# EAGLE design HeadsetCCup (EAGLE 6.5.0)
ECE477 Senior Design Project Augmented Reality Simulator board utilizing STM32F4 and Raspberry PI
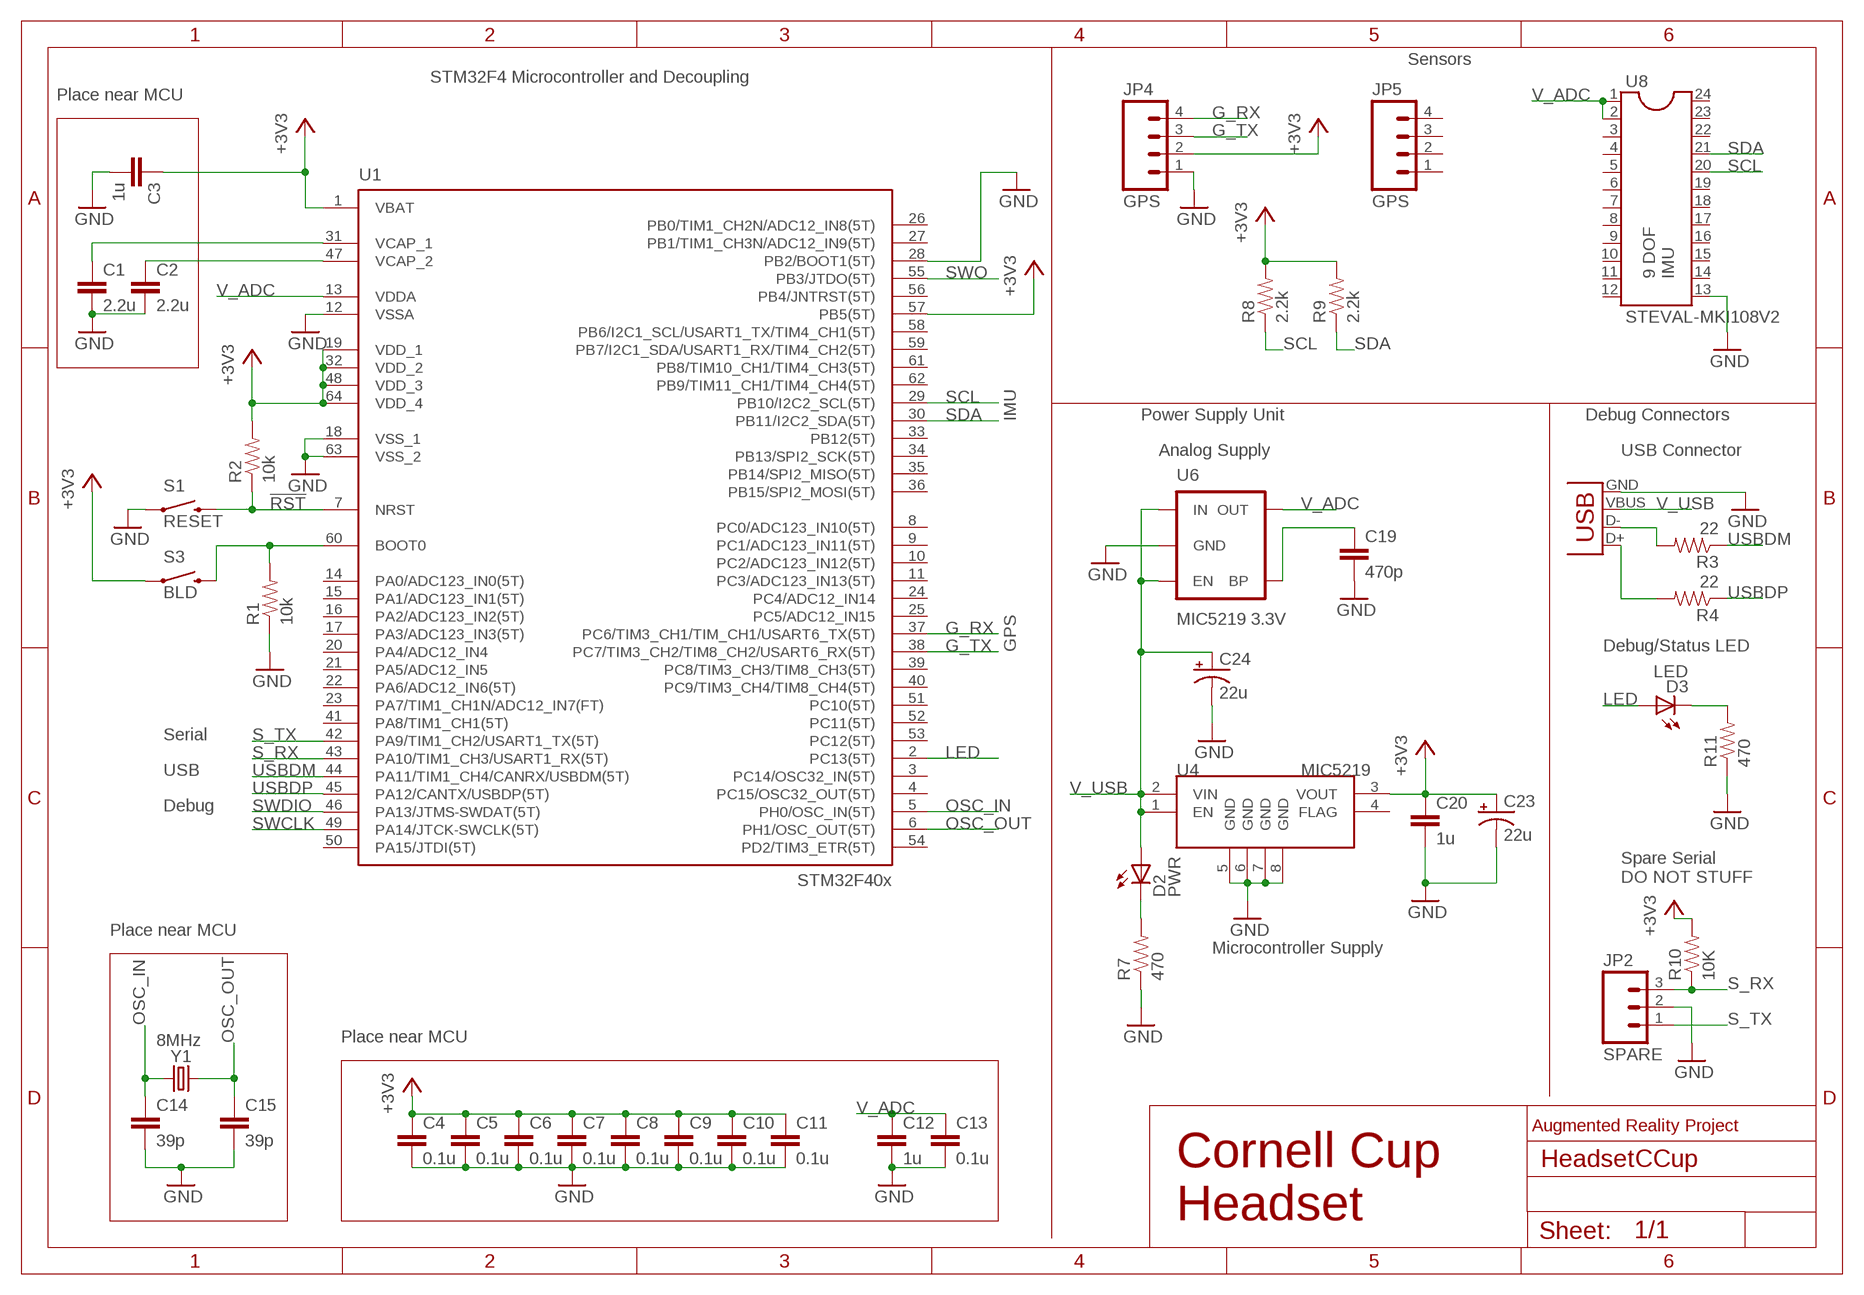
[diagram p0: schematic, sheet 1]

## Parts
C1  2.2u  CAP1206  [1206]
C2  2.2u  CAP1206  [1206]
C3  1u  CAP1206  [1206]
C4  0.1u  CAP1206  [1206]
C5  0.1u  CAP1206  [1206]
C6  0.1u  CAP1206  [1206]
C7  0.1u  CAP1206  [1206]
C8  0.1u  CAP1206  [1206]
C9  0.1u  CAP1206  [1206]
C10  0.1u  CAP1206  [1206]
C11  0.1u  CAP1206  [1206]
C12  1u  CAP1206  [1206]
C13  0.1u  CAP1206  [1206]
C14  39p  CAP1206  [1206]
C15  39p  CAP1206  [1206]
C19  470p  CAP1206  [1206]
C20  1u  CAP1206  [1206]
C23  22u  CAP_POLD  [PANASONIC_D]
C24  22u  CAP_POLD  [PANASONIC_D]
D2  PWR  LED-RED1206  [LED-1206]
D3  LED  LED-RED1206  [LED-1206]
JP1  USBSMD  [USB-MINIB]
JP2  SPARE  M03PTH  [1X03]
JP4  GPS  M04PTH  [1X04]
JP5  GPS  M04PTH  [1X04]
R1  10k  RES1206  [1206]
R2  10k  RES1206  [1206]
R3  22  RES1206  [1206]
R4  22  RES1206  [1206]
R7  470  RES1206  [1206]
R8  2.2k  RES1206  [1206]
R9  2.2k  RES1206  [1206]
R10  10K  RES1206  [1206]
R11  470  RES1206  [1206]
S1  RESET  SWITCH-MOMENTARY-2PTH  [TACTILE-PTH]
S3  BLD  SWITCH-MOMENTARY-2PTH  [TACTILE-PTH]
U1  STM32F405RGT6  STM32F405R  [TQFP64]
U4  MIC5219  V_REG_MIC5216  [MSOP8]
U6  MIC5219 3.3V  V_REG_MIC52193.3V  [SOT23-5]
U8  STEVAL-MKI108V2  DIL24-6  [DIL24-6]
Y1  8MHz  CRYSTALHC49US  [HC49US]

## Nets
!RST!: R2.1 S1.3 U1.7(NRST)
+3V3: C3.1 C4.1 C5.1 C6.1 C7.1 C8.1 C9.1 C10.1 C11.1 C20.1 C23.+ JP4.2 R2.2 R8.2 R9.2 R10.2 S3.1 U1.1(VBAT) U1.19(VDD_1) U1.32(VDD_2) U1.48(VDD_3) U1.57(PB5(5T)) U1.64(VDD_4) U4.3(VOUT)
BOOT0: R1.2 S3.3 U1.60(BOOT0)
G_RX: JP4.4 U1.37(PC6/TIM3_CH1/TIM_CH1/USART6_TX(5T))
G_TX: JP4.3 U1.38(PC7/TIM3_CH2/TIM8_CH2/USART6_RX(5T))
GND: C1.2 C2.2 C3.2 C4.2 C5.2 C6.2 C7.2 C8.2 C9.2 C10.2 C11.2 C12.2 C13.2 C14.2 C15.2 C19.2 C20.2 C23.- C24.- JP1.GND JP2.2 JP4.1 R1.1 R7.1 R11.1 S1.1 U1.12(VSSA) U1.18(VSS_1) U1.28(PB2/BOOT1(5T)) U1.63(VSS_2) U4.5(GND) U4.6(GND) U4.7(GND) U4.8(GND) U6.2(GND) U8.13
LED: D3.A U1.2(PC13(5T))
LED_LED: D3.C R11.2
OSC_IN: C14.1 U1.5(PH0/OSC_IN(5T)) Y1.1
OSC_OUT: C15.1 U1.6(PH1/OSC_OUT(5T)) Y1.2
PWR_LED: D2.C R7.2
S_RX: JP2.3 R10.1 U1.43(PA10/TIM1_CH3/USART1_RX(5T))
S_TX: JP2.1 U1.42(PA9/TIM1_CH2/USART1_TX(5T))
SCL: R8.1 U1.29(PB10/I2C2_SCL(5T)) U8.20
SDA: R9.1 U1.30(PB11/I2C2_SDA(5T)) U8.21
SWCLK: U1.49(PA14/JTCK-SWCLK(5T))
SWDIO: U1.46(PA13/JTMS-SWDAT(5T))
SWO: U1.55(PB3/JTDO(5T))
USB_D+: JP1.D+ R4.2
USB_D-: JP1.D- R3.2
USBDM: R3.1 U1.44(PA11/TIM1_CH4/CANRX/USBDM(5T))
USBDP: R4.1 U1.45(PA12/CANTX/USBDP(5T))
V_ADC: C12.1 C13.1 U1.13(VDDA) U6.5(OUT) U8.1 U8.2
V_BYP: C19.1 U6.4(BP)
V_USB: C24.+ D2.A JP1.VBUS U4.1(EN) U4.2(VIN) U6.1(IN) U6.3(EN)
VCAP1: C1.1 U1.31(VCAP_1)
VCAP2: C2.1 U1.47(VCAP_2)
Unconnected: JP5.1 JP5.2 JP5.3 JP5.4 U1.3(PC14/OSC32_IN(5T)) U1.4(PC15/OSC32_OUT(5T)) U1.8(PC0/ADC123_IN10(5T)) U1.9(PC1/ADC123_IN11(5T)) U1.10(PC2/ADC123_IN12(5T)) U1.11(PC3/ADC123_IN13(5T)) U1.14(PA0/ADC123_IN0(5T)) U1.15(PA1/ADC123_IN1(5T)) U1.16(PA2/ADC123_IN2(5T)) U1.17(PA3/ADC123_IN3(5T)) U1.20(PA4/ADC12_IN4) U1.21(PA5/ADC12_IN5) U1.22(PA6/ADC12_IN6(5T)) U1.23(PA7/TIM1_CH1N/ADC12_IN7(FT)) U1.24(PC4/ADC12_IN14) U1.25(PC5/ADC12_IN15) U1.26(PB0/TIM1_CH2N/ADC12_IN8(5T)) U1.27(PB1/TIM1_CH3N/ADC12_IN9(5T)) U1.33(PB12(5T)) U1.34(PB13/SPI2_SCK(5T)) U1.35(PB14/SPI2_MISO(5T)) U1.36(PB15/SPI2_MOSI(5T)) U1.39(PC8/TIM3_CH3/TIM8_CH3(5T)) U1.40(PC9/TIM3_CH4/TIM8_CH4(5T)) U1.41(PA8/TIM1_CH1(5T)) U1.50(PA15/JTDI(5T)) U1.51(PC10(5T)) U1.52(PC11(5T)) U1.53(PC12(5T)) U1.54(PD2/TIM3_ETR(5T)) U1.56(PB4/JNTRST(5T)) U1.58(PB6/I2C1_SCL/USART1_TX/TIM4_CH1(5T)) U1.59(PB7/I2C1_SDA/USART1_RX/TIM4_CH2(5T)) U1.61(PB8/TIM10_CH1/TIM4_CH3(5T)) U1.62(PB9/TIM11_CH1/TIM4_CH4(5T)) U4.4(FLAG) U8.3 U8.4 U8.5 U8.6 U8.7 U8.8 U8.9 U8.10 U8.11 U8.12 U8.14 U8.15 U8.16 U8.17 U8.18 U8.19 U8.22 U8.23 U8.24

## Notes on the sheet
- Sensors
- STM32F4 Microcontroller and Decoupling
- Place near MCU
- 9 DOF
  IMU
- IMU | Power Supply Unit | Debug Connectors
- Analog Supply | USB Connector
- GPS | Debug/Status LED
- Serial
- USB
- Debug
- Spare Serial
  DO NOT STUFF
- Place near MCU
- Microcontroller Supply
- Place near MCU
- Augmented Reality Project
- Cornell Cup
  Headset

## Library data of the parts
C1-C15 C19 C20 = ECE477:CAP: Capacitor Standard 0603 ceramic capacitor, and 0.1" leaded capacitor.
C23 C24 = SparkFun-Passives:CAP_POL: Capacitor Polarized These are standard SMD and PTH capacitors. Normally 10uF, 47uF, and 100uF in electrolytic and tantalum varieties. Always verify the external diameter of the through hole cap, it varies with capacity, voltage, and manufacturer. The EIA devices should be standard.
D2 D3 = SparkFun-LED:LED-RED: Assorted Red LEDs LilyPad 1206- DIO-09912 1206- DIO-00809 0603- DIO-00819; PROD_ID: DIO-00809; VALUE: RED
JP1 = SparkFun-Connectors:USB: USB Connectors USB-B-PTH is fully proven SKU : PRT-00139/CONN-08278 USB-miniB is fully proven SKU : PRT-00587 USB-A-PCB is untested. USB-A-H is throughly reviewed, but untested. Spark Fun Electronics SKU : PRT-00437 USB-B-SMT is throughly reviewed, but untested. Needs silkscreen touching up. USB-A-S has not been used/tested USB-MB-H has not been used/tested USB-MICROB has been used. CONN-09505
JP2 = SparkFun-Connectors:M03: Header 3 Standard 3-pin 0.1" header. Use with straight break away headers (SKU : PRT-00116), right angle break away headers (PRT-00553), swiss pins (PRT-00743), machine pins (PRT-00117), and female headers (PRT-00115). Molex polarized connector foot print use with SKU : PRT-08232 with associated crimp pins and housings.
JP4 JP5 = SparkFun-Connectors:M04: Header 4 Standard 4-pin 0.1" header. Use with straight break away headers (SKU : PRT-00116), right angle break away headers (PRT-00553), swiss pins (PRT-00743), machine pins (PRT-00117), and female headers (PRT-00115). Molex polarized connector foot print use with SKU : PRT-08231 with associated crimp pins and housings. 1MM SMD Version SKU: PRT-10208
R1-R4 R7-R11 = ECE477:RES: RESISTOR Surface-mount resistors
S1 S3 = SparkFun-Electromechanical:SWITCH-MOMENTARY-2: Various NO switches- pushbuttons, reed, etc
U1 = ECE477:STM32F405R: STM32F405 64 pin LQFP reviewed: YES tested: YES
U4 = SparkFun-PowerIC:V_REG_MIC5216: 500mA LDO, MSOP8 for better dissipation
U6 = SparkFun-PowerIC:V_REG_MIC5219: V_REG MIC5219 Standard 500mA LDO voltage regulator in SOT-23 layout. Micrel part MIC5219. BP (by-pass) pin is used to lower output noise with 470pF cap, may be left open.; PROD_ID: VREG-09872
U8 = ic-package:DIL24: Dual In Line
Y1 = SparkFun-FreqCtrl:CRYSTAL: Various standard crystals. Proven footprints. Spark Fun Electronics SKU : COM-00534

## Board
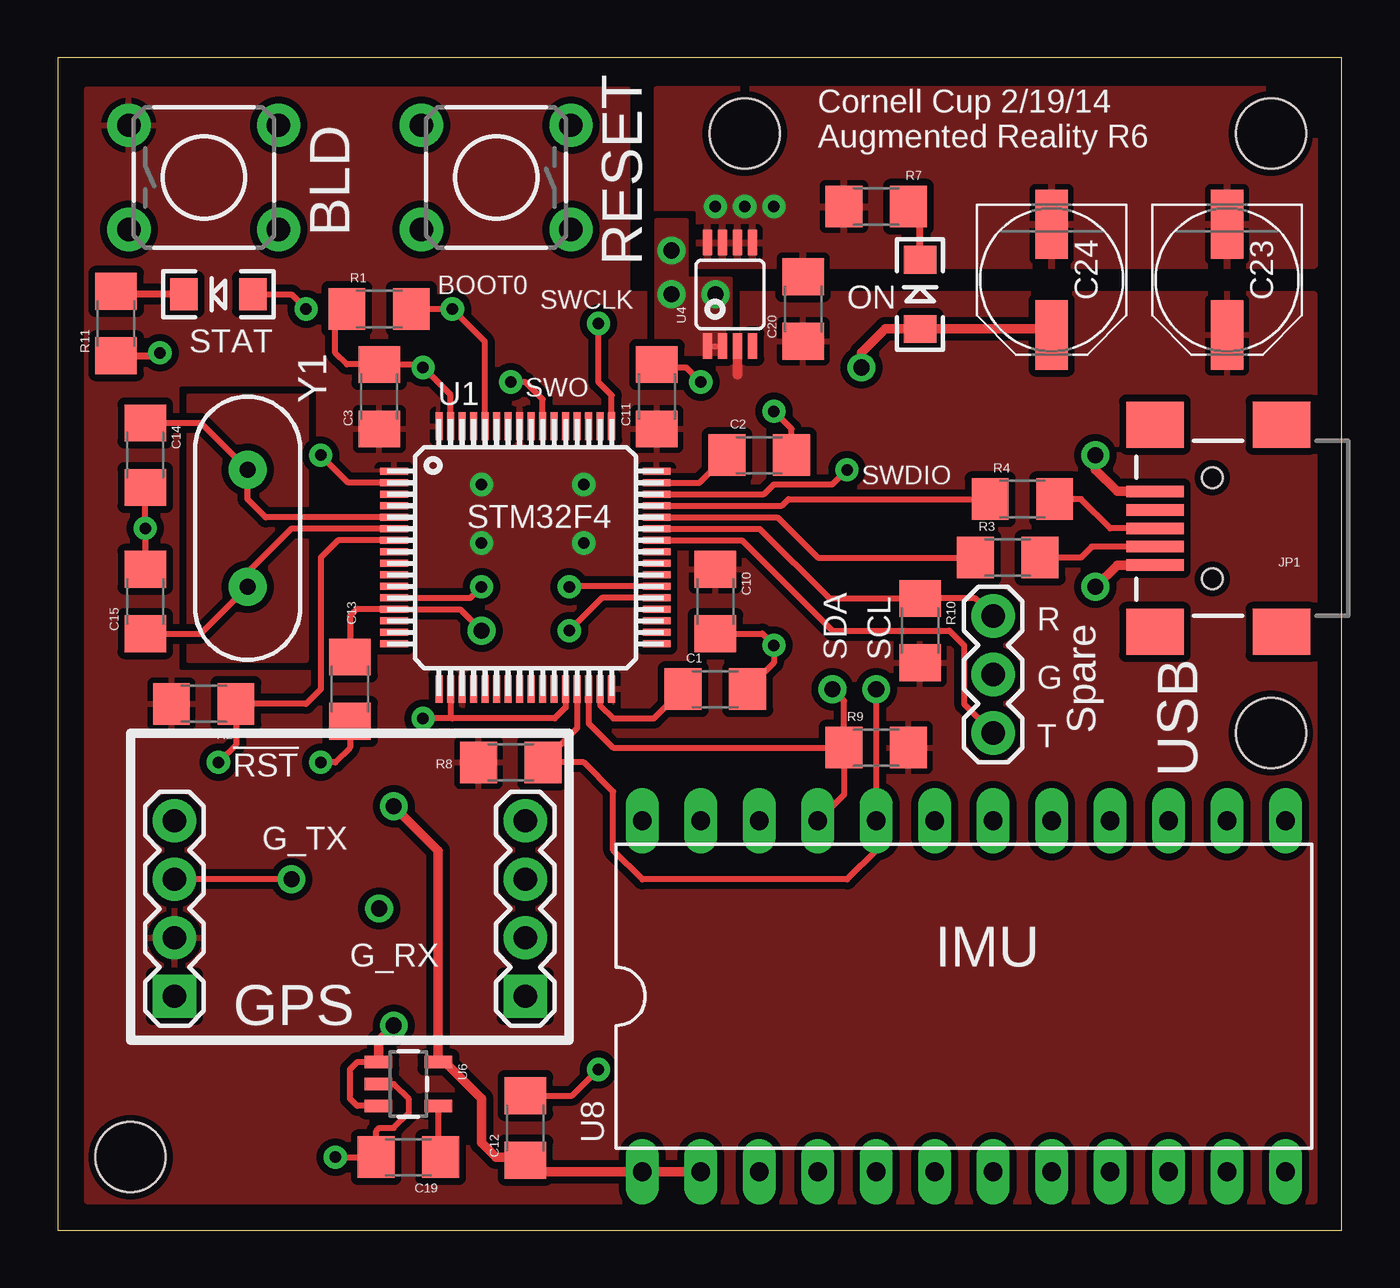
[diagram p1: board, top side]
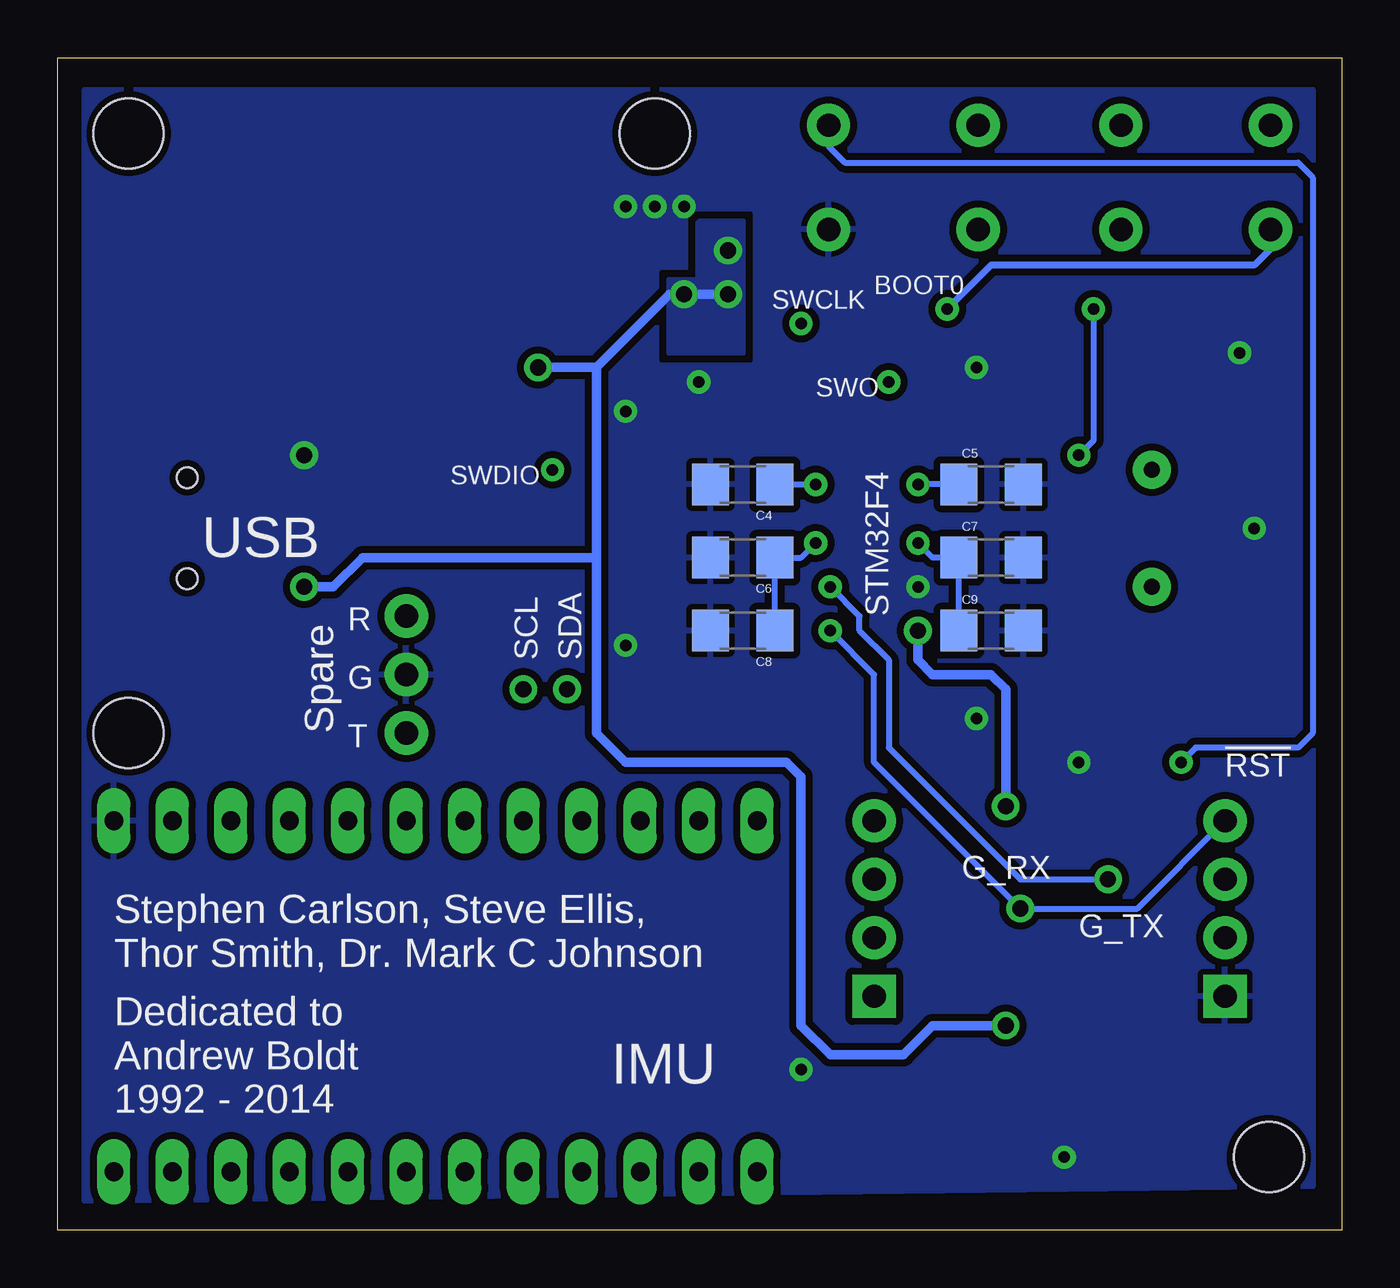
[diagram p2: board, bottom side, seen from below]

Size 55.79 x 50.92 mm. Coordinates in mm from the lower left corner, seen from the top.
Outline: 0,0 55.79,0 55.79,50.92 0,50.92 0,0
Copper layers (1*16): Top 0.035mm / dielectric 1.5mm / Bottom 0.035mm
Design rules "SparkFun *": minimum track width 8mil, minimum drill 15mil, track to track 8mil, track to pad 8mil, pad to pad 8mil, via to via 8mil, smd to smd 8mil, copper to edge 10mil, drill to drill 8mil, minimum pad ring 12mil, minimum via ring 10mil, stop-mask expansion 4mil, vias tented up to drill 25mil, thermal gap 10mil
Holes 3.05 mm at 52.7,47.62 3.17,3.17 29.84,47.62 52.7,21.59

### Footprints (pad centres in the part's own frame; a part is rotated, then mirrored left to right if it is on the bottom)
1206 = smd 1.6 x 1.8: 1 -1.4,0; 2 1.4,0
PANASONIC_D = smd 3 x 1.4: + 2.4,0; - -2.4,0
LED-1206 = smd 1.2 x 1.4: A -1.5,0; C 1.5,0
USB-MINIB = smd 2.5 x 0.5: D+ 2.5,0; D- 2.5,0.8; GND 2.5,-1.6; ID 2.5,-0.8; VBUS 2.5,1.6 | smd 2.5 x 2: MTN1 -3,4.5; MTN2 2.5,4.5; MTN3 -3,-4.5; MTN4 2.5,-4.5 | hole 0.9: 0,2.2; 0,-2.2
1X03 = drill 1.016 pad 1.88: 1 0,0; 2 2.54,0; 3 5.08,0
1X04 = drill 1.016 pad 1.88 square: 1 0,0 | drill 1.016 pad 1.88: 2 2.54,0; 3 5.08,0; 4 7.62,0
TACTILE-PTH = drill 1.016 pad 1.88: 1 -3.251,2.261; 2 3.251,2.261; 3 -3.251,-2.261; 4 3.251,-2.261
TQFP64 = smd 1.2 x 0.3: 1 -5.7,3.75; 2 -5.7,3.25; 3 -5.7,2.75; 4 -5.7,2.25; 5 -5.7,1.75; 6 -5.7,1.25; 7 -5.7,0.75; 8 -5.7,0.25; 9 -5.7,-0.25; 10 -5.7,-0.75; 11 -5.7,-1.25; 12 -5.7,-1.75; 13 -5.7,-2.25; 14 -5.7,-2.75; 15 -5.7,-3.25; 16 -5.7,-3.75; 33 5.7,-3.75; 34 5.7,-3.25; 35 5.7,-2.75; 36 5.7,-2.25; 37 5.7,-1.75; 38 5.7,-1.25; 39 5.7,-0.75; 40 5.7,-0.25; 41 5.7,0.25; 42 5.7,0.75; 43 5.7,1.25; 44 5.7,1.75; 45 5.7,2.25; 46 5.7,2.75; 47 5.7,3.25; 48 5.7,3.75 | smd 0.3 x 1.2: 17 -3.75,-5.7; 18 -3.25,-5.7; 19 -2.75,-5.7; 20 -2.25,-5.7; 21 -1.75,-5.7; 22 -1.25,-5.7; 23 -0.75,-5.7; 24 -0.25,-5.7; 25 0.25,-5.7; 26 0.75,-5.7; 27 1.25,-5.7; 28 1.75,-5.7; 29 2.25,-5.7; 30 2.75,-5.7; 31 3.25,-5.7; 32 3.75,-5.7; 49 3.75,5.7; 50 3.25,5.7; 51 2.75,5.7; 52 2.25,5.7; 53 1.75,5.7; 54 1.25,5.7; 55 0.75,5.7; 56 0.25,5.7; 57 -0.25,5.7; 58 -0.75,5.7; 59 -1.25,5.7; 60 -1.75,5.7; 61 -2.25,5.7; 62 -2.75,5.7; 63 -3.25,5.7; 64 -3.75,5.7
MSOP8 = smd 0.4 x 1.1: 1 -0.975,-2.25; 2 -0.325,-2.25; 3 0.325,-2.25; 4 0.975,-2.25; 5 0.975,2.25; 6 0.325,2.25; 7 -0.325,2.25; 8 -0.975,2.25
SOT23-5 = smd 0.55 x 1.2: 1 -0.95,-1.3; 2 0,-1.3; 3 0.95,-1.3; 4 0.95,1.3; 5 -0.95,1.3
DIL24-6 = drill 0.813 long: 1 -13.97,-7.62; 2 -11.43,-7.62; 3 -8.89,-7.62; 4 -6.35,-7.62; 5 -3.81,-7.62; 6 -1.27,-7.62; 7 1.27,-7.62; 8 3.81,-7.62; 9 6.35,-7.62; 10 8.89,-7.62; 11 11.43,-7.62; 12 13.97,-7.62; 13 13.97,7.62; 14 11.43,7.62; 15 8.89,7.62; 16 6.35,7.62; 17 3.81,7.62; 18 1.27,7.62; 19 -1.27,7.62; 20 -3.81,7.62; 21 -6.35,7.62; 22 -8.89,7.62; 23 -11.43,7.62; 24 -13.97,7.62
HC49US = drill 0.7 pad 1.651: 1 -2.54,0; 2 2.54,0

### Placement (x,y rotation side)
C1  28.57,23.5 0 top
C2  30.48,33.66 0 top
C3  13.97,36.2 90 top
C4  26.04,32.38 180 bottom
C5  15.24,32.38 0 bottom
C6  26.04,29.21 180 bottom
C7  15.24,29.21 0 bottom
C8  26.04,26.04 180 bottom
C9  15.24,26.04 0 bottom
C10  28.57,27.3 270 top
C11  26.04,36.2 90 top
C12  20.32,4.45 90 top
C13  12.7,23.5 270 top
C14  3.81,33.66 270 top
C15  3.81,27.3 90 top
C19  15.24,3.17 180 top
C20  32.38,40.01 90 top
C23  50.8,41.27 270 top
C24  43.18,41.27 270 top
D2  37.47,40.64 90 top
D3  6.99,40.64 180 top
JP1  50.16,30.48 180 top
JP2  40.64,21.59 90 top
JP4  5.08,10.16 90 top
JP5  20.32,10.16 90 top
R1  13.97,40.01 0 top
R2  6.35,22.86 180 top
R3  41.27,29.21 0 top
R4  41.91,31.75 0 top
R7  35.56,44.45 0 top
R8  19.68,20.32 180 top
R9  35.56,20.95 0 top
R10  37.47,26.04 270 top
R11  2.54,39.37 90 top
S1  19.05,45.72 180 top
S3  6.35,45.72 0 top
U1  20.32,29.21 0 top
U4  29.21,40.64 0 top
U6  15.24,6.35 270 top
U8  39.37,10.16 0 top
Y1  8.26,30.48 270 top

### Tracks (layer width: path | path; a pad name or v marks a point on that pad's centre or on a via)
!RST!  (via drill 0.5)
  Top 0.254: U1.7 12.18,29.96 11.43,29.21 11.43,23.5 10.79,22.86 R2.1 7.75,21.09 v6.99,20.32
  Bottom 0.254: S1.3 22.3,47.07 21.59,46.35 1.91,46.35 1.27,45.72 1.27,21.59 1.91,20.95 6.35,20.95 v6.99,20.32
+3V3  (via drill 0.5)
  Top 0.406: U4.3 29.54,37.14
  Bottom 0.254: C5.1 v18.41,32.38 | C4.1 v22.86,32.38 | v18.41,29.84 17.78,29.21 C7.1 C9.1 | C6.1 24.13,29.21 | 24.13,29.21 23.5,29.21 v22.86,29.84 | C8.1 24.64,28.7 24.13,29.21
  pour Top (isolate 0.305, rank 2): 1.27,49.53 1.27,1.27 54.61,1.27 54.61,40.64 24.77,40.64 24.77,49.53
  pour Top (no thermals): 17.14,24.77 17.14,22.86 17.78,22.86 17.78,24.77
  pour Top (no thermals): 19.68,35.56 19.68,33.66 20.95,33.66 20.95,35.56
BOOT0  (via drill 0.5)
  Top 0.254: U1.60 18.57,38.58 v17.14,40.01 R1.2
  Bottom 0.305: S3.3 3.1,42.62 3.81,41.91 15.24,41.91 v17.14,40.01
G_RX  (via drill 0.5, 0.7)
  Top 0.254: U1.37 23.65,27.46 v22.23,26.04
  Bottom 0.254: v22.23,26.04 20.32,24.13 20.32,20.32 v13.97,13.97 8.89,13.97 JP4.4
G_TX  (via drill 0.5, 0.7)
  Top 0.254: U1.38 22.25,27.96 v22.23,27.94 | v10.16,15.24 JP4.3
  Bottom 0.254: v10.16,15.24 13.97,15.24 19.68,20.95 19.68,24.77 20.95,26.04 20.95,26.67 v22.23,27.94
GND  (via drill 0.5, 0.7)
  Top 0.254: U1.63 17.07,36.27 v15.88,37.47 15.74,37.59 C3.2 12.57,37.59 12.06,38.1 12.06,39.5 R1.1 | C1.2 31.11,24.64 v31.11,25.4 30.61,25.91 C10.2 | U1.18 17.07,22.3 17.14,22.23 | C11.2 26.04,37.47 27.3,37.47 v27.94,36.83 | U6.2 14.61,6.35 15.24,5.71 15.24,5.08 14.61,4.45 13.97,4.45 13.84,4.32 C19.2 v12.06,3.17 | C13.2 12.7,20.95 12.06,20.32 v11.43,20.32 | U1.12 17.93,27.46 v18.41,27.94 | C2.2 31.88,34.8 v31.11,35.56 | U1.28 22.07,22.7 21.59,22.23 17.14,22.23 | 17.14,22.23 v15.88,22.23 | C12.2 22.36,5.84 v23.5,6.99 | C14.2 v3.81,30.48 C15.2
  Top 0.305: R11.1 4.32,37.97 v4.45,38.1
  Top 0.406: JP1.GND 46.02,32.08 45.09,33.02 v45.09,33.66
  other vias: 28.57,44.45 29.84,44.45 31.11,44.45
  pour Bottom (isolate 0.305, rank 2): 1.27,49.53 1.27,1.91 54.61,1.27 54.61,49.53
  pour Top (isolate 0.305, rank 2): 26.04,49.53 26.04,41.91 54.61,41.91 54.61,49.53
LED  (via drill 0.5)
  Top 0.254: v11.43,33.66 12.62,32.46 U1.2 | D3.A 10.16,40.64 v10.79,40.01
  Bottom 0.254: v10.79,40.01 10.79,34.29 v11.43,33.66
LED_LED
  Top 0.305: D3.C 3.04,40.64 R11.2
OSC_IN
  Top 0.254: U1.5 9.04,30.96 8.26,31.75 Y1.1 6.22,35.05 C14.1
OSC_OUT
  Top 0.254: U1.6 10.14,30.46 8.26,28.57 Y1.2 6.22,25.91 C15.1
PWR_LED
  Top 0.305: D2.C 37.47,43.95 R7.2
S_RX
  Top 0.254: U1.43 30.5,30.46 33.52,27.43 R10.1 39.88,27.43 JP2.3
S_TX
  Top 0.254: U1.42 29.73,29.96 33.66,26.04 38.73,26.04 39.37,25.4 39.37,22.86 JP2.1
SCL  (via drill 0.7)
  Top 0.254: U1.29 22.57,21.8 R8.1 22.86,20.32 24.13,19.05 24.13,16.51 25.4,15.24 34.29,15.24 35.56,16.51 U8.20 v35.56,23.5
SDA  (via drill 0.7)
  Top 0.254: U1.30 23.07,22.02 24.13,20.95 R9.1 | R9.1 34.16,22.99 v33.66,23.5 | R9.1 34.16,18.92 U8.21
SWCLK  (via drill 0.5)
  Top 0.254: U1.49 24.07,36.26 23.5,36.83 v23.5,39.37
SWDIO  (via drill 0.5)
  Top 0.254: U1.46 30.69,31.96 31.11,32.38 33.66,32.38 v34.29,33.02
SWO  (via drill 0.5)
  Top 0.254: U1.55 21.07,36.08 20.32,36.83 v19.68,36.83
USB_D+
  Top 0.254: JP1.D+ 45.72,30.48 44.45,31.75 R4.2
USB_D-
  Top 0.254: JP1.D- 44.92,29.68 44.45,29.21 R3.2
USBDM
  Top 0.254: U1.44 31.27,30.96 33.02,29.21 R3.1
USBDP
  Top 0.254: U1.45 31.46,31.46 31.75,31.75 R4.1
V_ADC  (via drill 0.7)
  Top 0.254: C13.1 12.7,26.67 12.99,26.96 U1.13 17.49,26.96 v18.41,26.04 | 20.19,3.17 C12.1
  Top 0.406: U8.2 U8.1 20.82,2.54 C12.1 | 20.19,3.17 19.05,3.17 18.41,3.81 18.41,5.71 16.83,7.3 U6.5 16.54,16.48 v14.61,18.41
  Bottom 0.406: v14.61,18.41 14.61,23.5 15.24,24.13 17.78,24.13 18.41,24.77 v18.41,26.04
V_BYP
  Top 0.254: U6.4 16.54,3.27 C19.1
V_USB  (via drill 0.7)
  Top 0.254: U4.1 U4.2 | U6.3 13.02,5.4 12.7,5.71 12.7,6.99 13.02,7.3 U6.1
  Top 0.406: U6.1 13.94,8.22 v14.61,8.89 | v34.92,37.47 34.92,38.1 35.97,39.14 D2.A 42.91,39.14 C24.+ | JP1.VBUS 46.02,28.88 v45.09,27.94
  Bottom 0.406: v14.61,8.89 17.78,8.89 19.05,7.62 22.23,7.62 23.5,8.89 23.5,19.68 24.13,20.32 31.11,20.32 32.38,21.59 32.38,29.21 | 32.38,29.21 32.38,37.47 | 32.38,37.47 29.21,40.64 v28.57,40.64 v26.67,40.64 | 32.38,37.47 v34.92,37.47 | v45.09,27.94 43.81,27.94 42.55,29.21 32.38,29.21
  other vias: 26.67,42.55
  pour Top (isolate 0.305): 5.71,36.2 5.71,24.77 10.79,24.77 10.79,36.2
  pour Bottom (isolate 0.305): 26.04,43.81 26.04,38.1 29.21,38.1 29.21,41.27 27.94,41.27 27.94,43.81
  pour Top (isolate 0.305, no thermals): 26.04,43.81 26.04,38.1 29.21,38.1 29.21,41.27 27.3,41.27 27.3,43.81
VCAP1
  Top 0.254: U1.31 23.57,22.79 24.13,22.23 25.91,22.23 C1.1
VCAP2
  Top 0.254: U1.47 27.89,32.46 C2.1

### Text on the board
tPlace: Cornell Cup 2/19/14 / Augmented Reality R6 | BLD | RESET | BOOT0 | SWCLK | ON | STAT | SWO | SWDIO | STM32F4 | R | SDA | SCL | G | Spare | T | !RST! | USB | G_TX | G_RX | IMU | GPS
bPlace: BOOT0 | SWCLK | SWO | SWDIO | USB | STM32F4 | R | SDA | SCL | G | Spare | T | !RST! | G_RX | G_TX | Stephen Carlson, Steve Ellis, / Thor Smith, Dr. Mark C Johnson | IMU | Dedicated to / Andrew Boldt / 1992 - 2014